# EAGLE design Leak Detector Remote v1_0 (EAGLE 7.2.0)
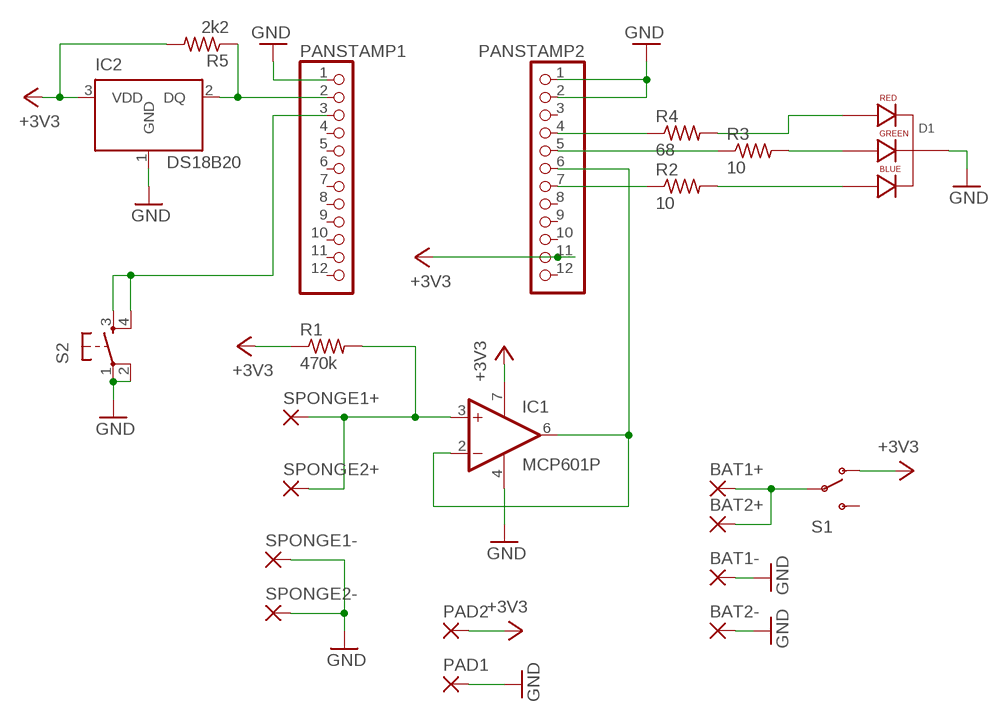
[diagram p0: schematic, sheet 1]

## Parts
BAT1+  3,81/1,4  [3,81/1,4]
BAT1-  3,81/1,4  [3,81/1,4]
BAT2+  3,81/1,4  [3,81/1,4]
BAT2-  3,81/1,4  [3,81/1,4]
D1  LED-RGB-CC-THRUCLEAR  [LED-RGB-THRU]
IC1  MCP601P  [DIL08]
IC2  DS18B20  DS1820  [TO-92]
PAD1  1,6/0,9  [1,6/0,9]
PAD2  1,6/0,9  [1,6/0,9]
PANSTAMP1  PINHD-1X12  [1X12]
PANSTAMP2  PINHD-1X12  [1X12]
R1  470k  R-US_0204/7  [0204/7]
R2  10  R-US_0204/7  [0204/7]
R3  10  R-US_0204/7  [0204/7]
R4  68  R-US_0204/7  [0204/7]
R5  2k2  R-US_0204/7  [0204/7]
S1  SWITCH-SPDTKIT  [SWITCH-SPDT_KIT]
S2  TAC_SWITCHPTH  [TACTILE-PTH]
SPONGE1+  3,81/1,4  [3,81/1,4]
SPONGE1-  3,81/1,4  [3,81/1,4]
SPONGE2+  3,81/1,4  [3,81/1,4]
SPONGE2-  3,81/1,4  [3,81/1,4]

## Nets
+3V3: IC1.7(V+) IC2.3(VDD) PAD2.1(P) PANSTAMP2.11 R1.1 R5.2 S1.1(O)
D3: PANSTAMP2.7 R2.1
D4: IC1.2(-IN) IC1.6(OUT) PANSTAMP2.6
D5: PANSTAMP2.5 R3.1
D6: PANSTAMP2.4 R4.1
D8: IC2.2(DQ) PANSTAMP1.2 R5.1
D9: PANSTAMP1.3 S2.3 S2.4
GND: BAT1-.1(P) BAT2-.1(P) D1.2(CATHODE) IC1.4(V-) IC2.1(GND) PAD1.1(P) PANSTAMP1.1 PANSTAMP2.1 PANSTAMP2.2 S2.1 S2.2 SPONGE1-.1(P) SPONGE2-.1(P)
N$2: IC1.3(+IN) R1.2 SPONGE1+.1(P) SPONGE2+.1(P)
N$4: BAT1+.1(P) BAT2+.1(P) S1.2(P)
N$7: D1.1(RED_CATHODE) R4.2
N$10: D1.3(GREEN_CATHODE) R3.2
N$11: D1.4(BLUE_CATHODE) R2.2
Unconnected: PANSTAMP1.4 PANSTAMP1.5 PANSTAMP1.6 PANSTAMP1.7 PANSTAMP1.8 PANSTAMP1.9 PANSTAMP1.10 PANSTAMP1.11 PANSTAMP1.12 PANSTAMP2.3 PANSTAMP2.8 PANSTAMP2.9 PANSTAMP2.10 PANSTAMP2.12 S1.3(S)

## Library data of the parts
BAT1+ BAT1- BAT2+ BAT2- SPONGE1+ SPONGE1- SPONGE2+ SPONGE2- = wirepad:3,81/1,4: THROUGH-HOLE PAD
D1 = SparkFun-LED:LED-RGB-CC-THRU: RGB Through-hole common cathode LED SparkFun Storefront: COM-00105 (Clear) COM-09264 (Diffuse); PROD_ID: DIO-08418
IC1 = linear:MCP601: Single Op Amp 2.7V to 6.0V Single Supply CMOS Source: http://ww1.microchip.com/downloads/en/DeviceDoc/21314g.pdf
IC2 = DS1820:DS1820: DS1820 - 1-Wire Digital Thermometer
PAD1 PAD2 = wirepad:1,6/0,9: THROUGH-HOLE PAD
PANSTAMP1 PANSTAMP2 = adafruit:PINHD-1X12: PIN HEADER
R1-R5 = resistor:R-US_: RESISTOR, American symbol
S1 = SparkFun-Electromechanical:SWITCH-SPDT: SPDT Switch Simple slide switch, Spark Fun Electronics SKU : COM-00102 DPDT SMT slide switch, AYZ0202, SWCH-08179
S2 = SparkFun-Electromechanical:TAC_SWITCH: Momentary Switch Button commonly used for reset or general input. Spark Fun Electronics SKU : COM-00097 SMT- SWCH-08247

## Net classes
0 default: width 0.254 mm, drill 0.508 mm, clearance 0.33 mm

## Board
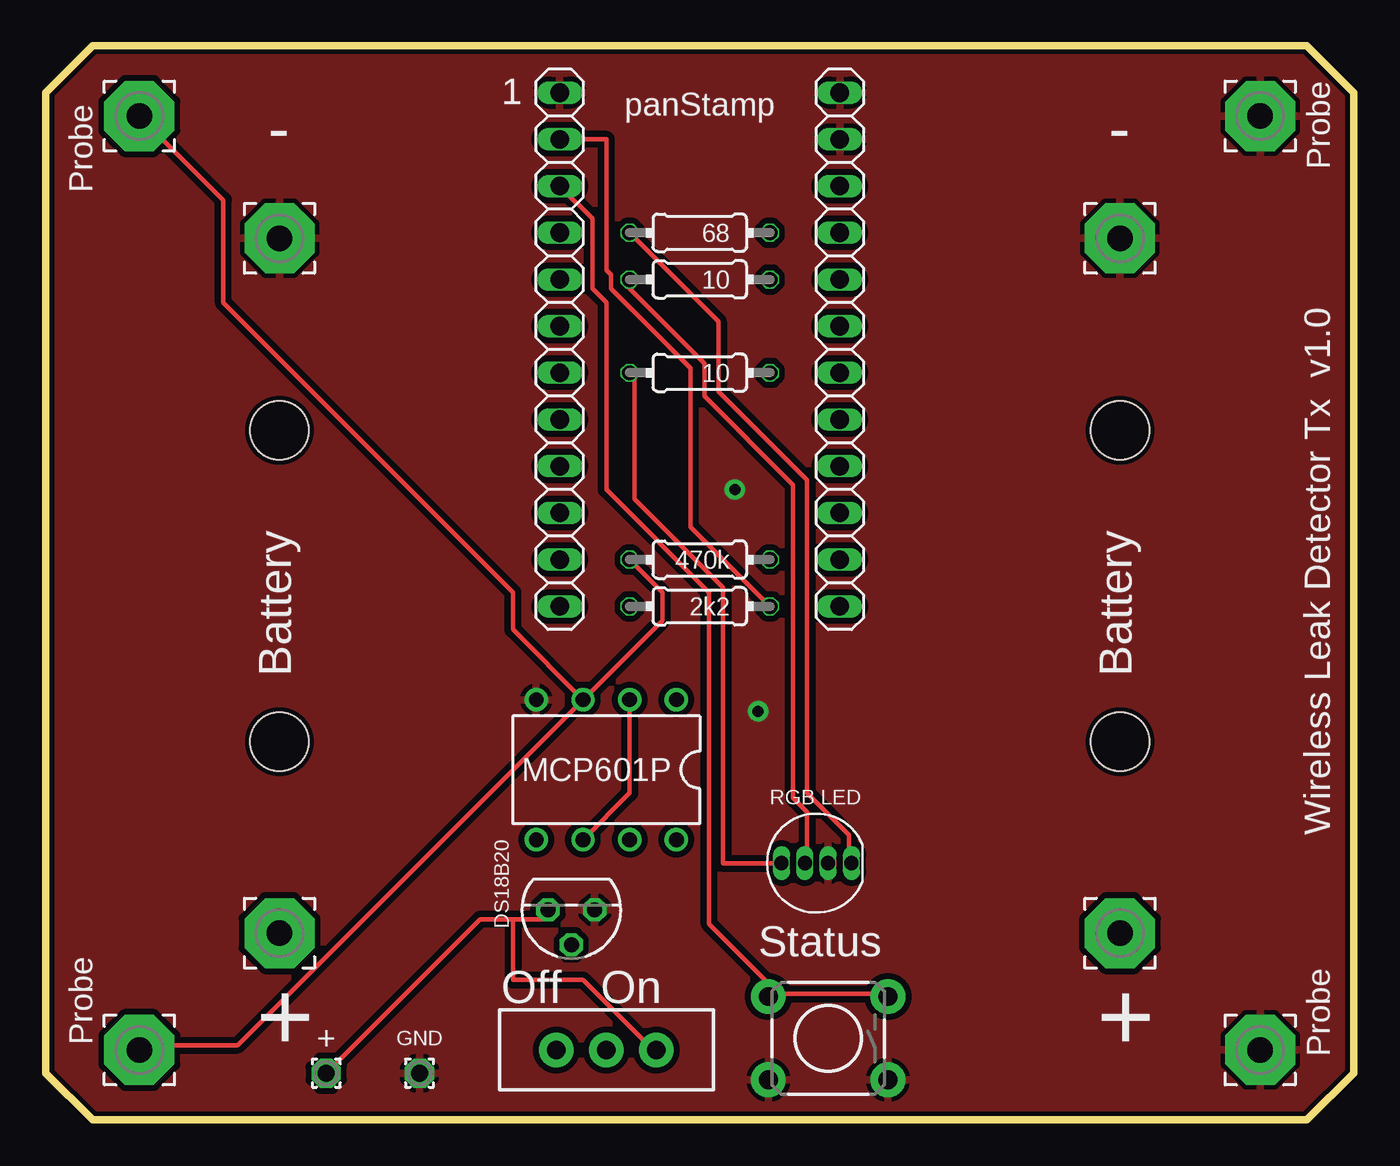
[diagram p1: board, top side]
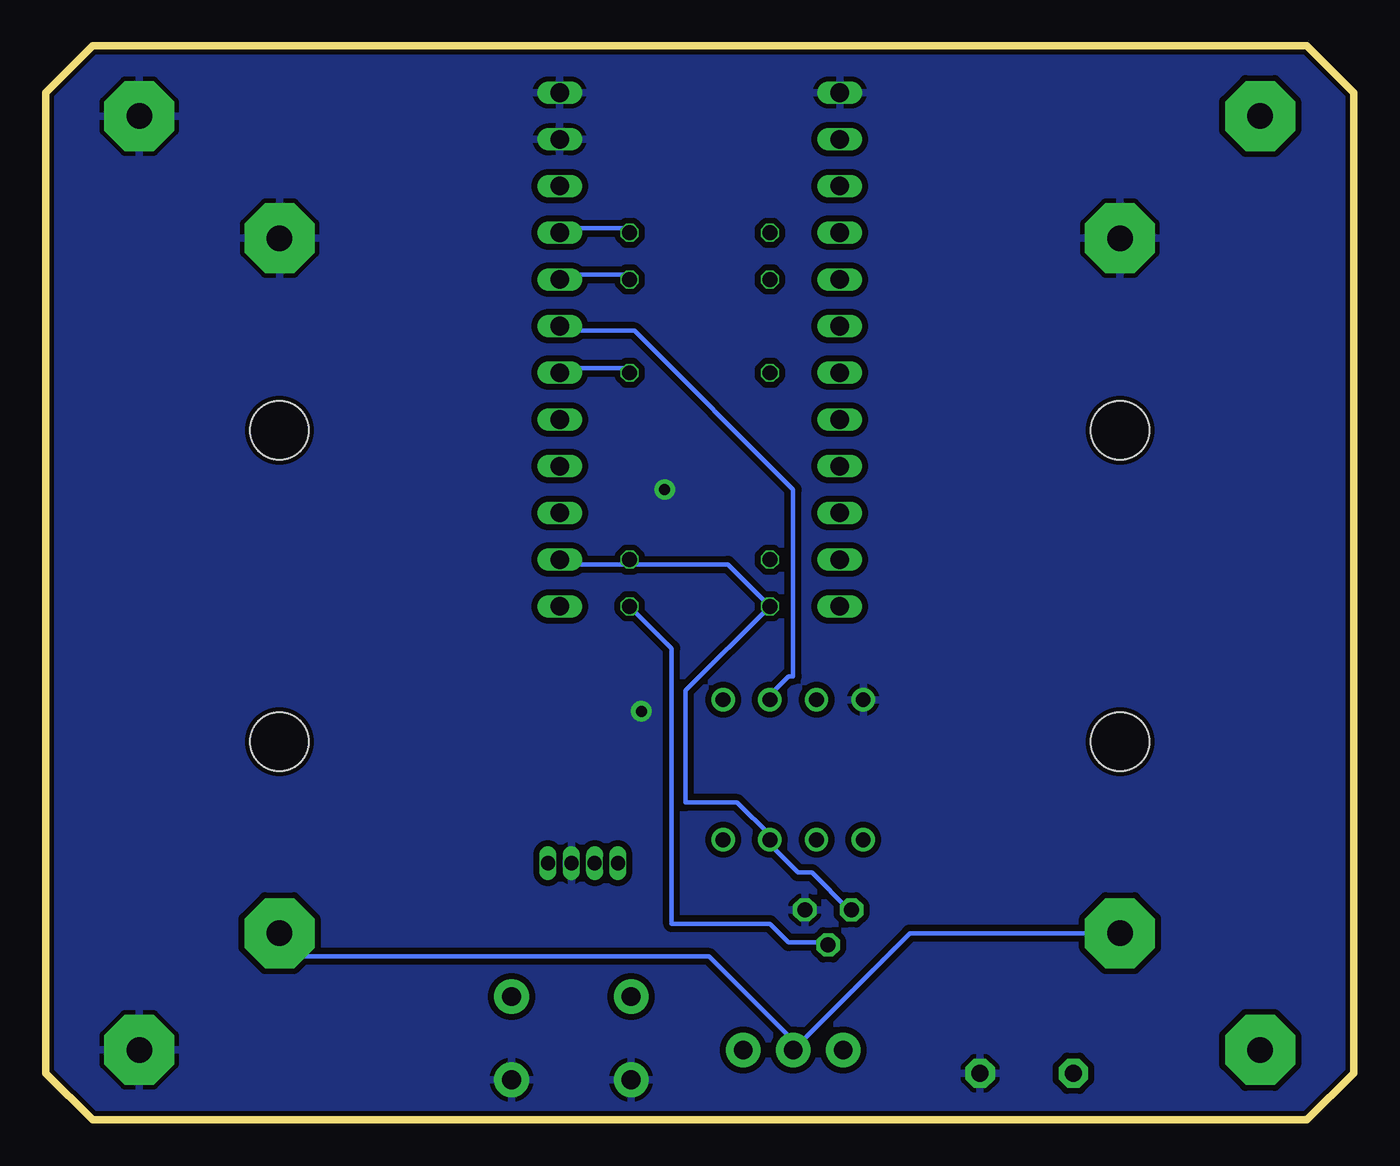
[diagram p2: board, bottom side, seen from below]

Size 71.12 x 58.42 mm. Coordinates in mm from the lower left corner, seen from the top.
Outline: 2.54,0 68.58,0 71.12,2.54 71.12,55.88 68.58,58.42 2.54,58.42 0,55.88 0,2.54 2.54,0
Copper layers (1*16): Top 0.035mm / dielectric 1.5mm / Bottom 0.035mm
Design rules "SparkFun10mil *": minimum track width 10mil, minimum drill 20mil, track to track 10mil, track to pad 10mil, pad to pad 10mil, via to via 10mil, smd to smd 10mil, copper to edge 10mil, drill to drill 10mil, minimum pad ring 0mil, minimum via ring 10mil, stop-mask expansion 4mil, vias tented up to drill 25mil, thermal gap 10mil
Holes 3.2 mm at 12.7,37.52 12.7,20.57 58.42,37.52 58.42,20.57

### Footprints (pad centres in the part's own frame; a part is rotated, then mirrored left to right if it is on the bottom)
3,81/1,4 = drill 1.397 pad 3.81 octagon: 1 0,0
LED-RGB-THRU = drill 0.762 pad 0.889 long: 1 1.905,0; 2 0.635,0; 3 -0.635,0; 4 -1.905,0
DIL08 = drill 0.813 pad 1.27: 1 -3.81,-3.81; 2 -1.27,-3.81; 3 1.27,-3.81; 4 3.81,-3.81; 5 3.81,3.81; 6 1.27,3.81; 7 -1.27,3.81; 8 -3.81,3.81
TO-92 = drill 0.813 pad 1.27 octagon: 1 -1.27,0; 2 0,1.905; 3 1.27,0
1,6/0,9 = drill 0.914 pad 1.6 octagon: 1 0,0
1X12 = drill 1.016 long: 1 -13.97,0; 2 -11.43,0; 3 -8.89,0; 4 -6.35,0; 5 -3.81,0; 6 -1.27,0; 7 1.27,0; 8 3.81,0; 9 6.35,0; 10 8.89,0; 11 11.43,0; 12 13.97,0
0204/7 = drill 0.813 octagon: 1 -3.81,0; 2 3.81,0
SWITCH-SPDT_KIT = drill 1.016 pad 1.88: 1 0,2.718; 2 0,0; 3 0,-2.718
TACTILE-PTH = drill 1.016 pad 1.88: 1 -3.251,2.261; 2 3.251,2.261; 3 -3.251,-2.261; 4 3.251,-2.261

### Placement (x,y rotation side)
BAT1+  58.42,10.16 0 top
BAT1-  58.42,47.96 0 top
BAT2+  12.7,10.16 0 top
BAT2-  12.7,47.96 0 top
D1  41.91,13.97 0 top
IC1  30.48,19.05 180 top
IC2  28.57,11.43 180 top
PAD1  20.32,2.54 0 top
PAD2  15.24,2.54 0 top
PANSTAMP1  27.94,41.91 270 top
PANSTAMP2  43.18,41.91 270 top
R1  35.56,30.48 180 top
R2  35.56,40.64 180 top
R3  35.56,45.72 180 top
R4  35.56,48.26 180 top
R5  35.56,27.94 180 top
S1  30.48,3.81 270 top
S2  42.55,4.45 180 top
SPONGE1+  5.08,3.81 0 top
SPONGE1-  66.04,54.61 0 top
SPONGE2+  5.08,54.61 0 top
SPONGE2-  66.04,3.81 0 top

### Tracks (layer width: path | path; a pad name or v marks a point on that pad's centre or on a via)
+3V3
  Top 0.254: PAD2.1 23.62,10.92 25.4,10.92 | 25.4,10.92 27.18,10.92 27.18,11.43 IC2.3 | 25.4,10.92 25.4,7.62 29.21,7.62 33.02,3.81 S1.1
  Bottom 0.254: 39.12,30.23 34.04,30.23 R5.2 36.32,23.37 36.32,17.27 33.53,17.27 31.75,15.49 IC1.7 31.75,14.99 30.23,13.46 29.46,13.46 27.43,11.43 IC2.3 | PANSTAMP2.11 42.93,30.23 39.12,30.23 | 39.12,30.23 R1.1
D3
  Bottom 0.254: R2.1 39.62,40.89 42.93,40.89 PANSTAMP2.7
D4
  Top 0.254: IC1.6 31.75,17.78 IC1.2
  Bottom 0.254: PANSTAMP2.6 42.93,42.93 39.12,42.93 30.48,34.29 30.48,24.13 30.73,24.13 31.75,23.11 IC1.2
D5
  Bottom 0.254: R3.1 39.62,45.97 42.93,45.97 PANSTAMP2.5
D6
  Bottom 0.254: R4.1 39.62,48.51 42.93,48.51 PANSTAMP2.4
D8
  Top 0.254: PANSTAMP1.2 30.48,53.34 30.48,46.23 30.73,45.97 30.73,45.21 35.05,40.89 35.05,32.26 R5.1
  Bottom 0.254: R5.1 37.08,25.65 37.08,10.67 31.75,10.67 30.73,9.65 28.7,9.65 IC2.2
D9
  Top 0.254: PANSTAMP1.3 29.72,49.02 29.72,45.21 30.48,44.45 30.48,34.29 36.07,28.7 36.07,10.67 39.12,7.62 39.12,6.86 S2.4 39.37,6.86 45.72,6.86 S2.3
GND  (via drill 0.6)
  other vias: 37.47,34.29 38.73,22.23
  pour Top: 0,58.42 71.12,58.42 71.12,0 -2.54,0 -2.54,58.42
  pour Bottom: -2.54,58.42 71.12,58.42 71.12,-2.54 -2.54,-2.54
N$2
  Top 0.254: R1.2 33.53,28.7 33.53,27.18 IC1.3 | IC1.3 10.41,4.06 5.08,4.06 SPONGE1+.1 | SPONGE2+.1 9.65,50.04 9.65,44.45 25.4,28.7 25.4,26.67 IC1.3
N$4
  Bottom 0.254: 30.23,4.06 24.13,10.16 BAT2+.1 | BAT1+.1 57.15,8.89 35.05,8.89 30.23,4.06 | 30.23,4.06 S1.2
N$7
  Top 0.254: R4.2 36.58,43.43 36.58,39.62 41.4,34.8 41.4,17.78 43.69,15.49 43.69,13.97 D1.1
N$10
  Top 0.254: R3.2 31.75,45.21 35.81,41.15 35.81,39.37 40.64,34.54 40.64,17.53 41.4,16.76 41.4,13.97 D1.3
N$11
  Top 0.254: D1.4 36.83,13.97 36.83,28.96 32,33.78 32,40.39 R2.2

### Text on the board
tPlace: Probe | Probe | 1 | panStamp | - | - | Wireless Leak Detector Tx v1.0 | Battery | Battery | RGB LED | Probe | Status | Probe | Off On | + | + | GND | +